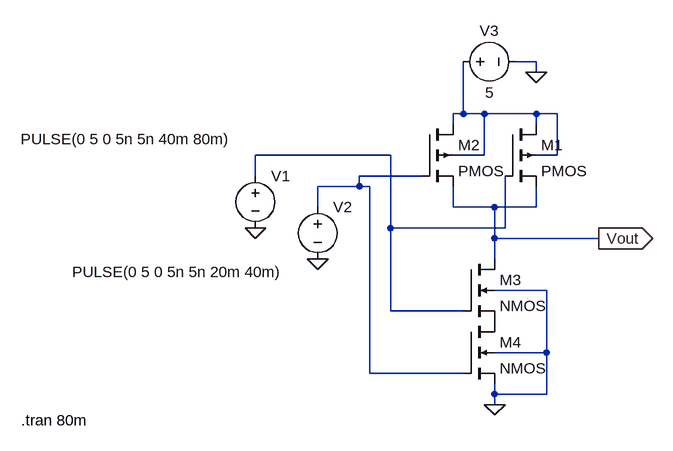
[diagram p0: schematic CMOS NAND GATE.asc]
CMOS NAND GATE.asc, the LTspice schematic file:
Version 4.1
SHEET 1 880 680
WIRE 272 -96 240 -96
WIRE 272 -80 272 -96
WIRE 160 -16 160 -96
WIRE 160 -16 144 -16
WIRE 192 -16 160 -16
WIRE 272 -16 192 -16
WIRE 304 -16 272 -16
WIRE 144 0 144 -16
WIRE 272 0 272 -16
WIRE 48 48 -160 48
WIRE 192 48 192 -16
WIRE 192 48 144 48
WIRE 304 48 304 -16
WIRE 304 48 272 48
WIRE -160 80 -160 48
WIRE 96 80 0 80
WIRE 0 96 0 80
WIRE 0 96 -64 96
WIRE 16 96 0 96
WIRE -64 128 -64 96
WIRE 144 128 144 96
WIRE 208 128 144 128
WIRE 272 128 272 96
WIRE 272 128 208 128
WIRE 48 160 48 48
WIRE 224 160 224 80
WIRE 224 160 48 160
WIRE 208 176 208 128
WIRE 368 176 208 176
WIRE 208 208 208 176
WIRE 288 256 208 256
WIRE 48 288 48 160
WIRE 160 288 48 288
WIRE 288 352 288 256
WIRE 288 352 208 352
WIRE 16 384 16 96
WIRE 160 384 16 384
WIRE 208 416 208 400
WIRE 288 416 288 352
WIRE 288 416 208 416
WIRE 208 432 208 416
FLAG 272 -80 0
FLAG 208 432 0
FLAG 368 176 Vout
IOPIN 368 176 Out
FLAG -160 160 0
FLAG -64 208 0
SYMBOL pmos4 224 0 R0
SYMATTR InstName M1
SYMBOL pmos4 96 0 R0
SYMATTR InstName M2
SYMBOL nmos4 160 208 R0
SYMATTR InstName M3
SYMBOL nmos4 160 304 R0
SYMATTR InstName M4
SYMBOL voltage -160 64 R0
WINDOW 3 -361 -41 Left 2
WINDOW 123 0 0 Left 0
WINDOW 39 0 0 Left 0
SYMATTR InstName V1
SYMATTR Value PULSE(0 5 0 5n 5n 40m 80m)
SYMBOL voltage -64 112 R0
WINDOW 3 -378 116 Left 2
WINDOW 123 0 0 Left 0
WINDOW 39 0 0 Left 0
SYMATTR InstName V2
SYMATTR Value PULSE(0 5 0 5n 5n 20m 40m)
SYMBOL voltage 144 -96 R270
WINDOW 0 32 56 VTop 2
WINDOW 3 -32 56 VBottom 2
WINDOW 123 0 0 Left 0
WINDOW 39 0 0 Left 0
SYMATTR InstName V3
SYMATTR Value 5
TEXT -520 456 Left 2 !.tran 80m

The netlist it stands for:
* CMOS NAND GATE.asc
M1 N001 N002 Vout N001 PMOS
M2 N001 N003 Vout N001 PMOS
M3 Vout N002 P001 0 NMOS
M4 P001 N003 0 0 NMOS
V1 N002 0 PULSE(0 5 0 5n 5n 40m 80m)
V2 N003 0 PULSE(0 5 0 5n 5n 20m 40m)
V3 N001 0 5
.model NMOS NMOS
.model PMOS PMOS
.lib standard.mos
.tran 80m
.backanno
.end